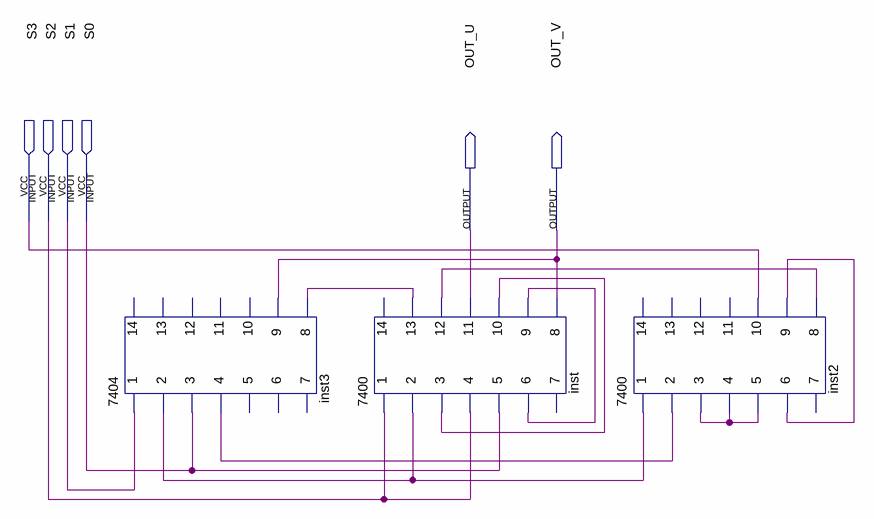
[diagram p0: schematic sheet]
// Quartus schematic BCD_chip_level_reference.bdf as structural Verilog: 3 symbols, 6 pins
module BCD_chip_level_reference (
  input  S3,
  input  S2,
  input  S1,
  input  S0,
  output OUT_U,
  output OUT_V
);

  wire inst2_3, inst2_6, inst2_8, inst3_2, inst3_4, inst3_8, inst_3, inst_6;

  \7404  inst3 (
    .\1 (S1), .\3 (S0), .\9 (OUT_V), .\2 (inst3_2), .\4 (inst3_4), .\8 (inst3_8));  // open: 7, 14, 5, 11, 13, 6, 10, 12
  \7400  inst (
    .\1 (S2), .\2 (inst3_2), .\4 (S2), .\5 (S0), .\9 (inst_6), .\10 (inst_3), .\12 (inst2_8), .\13 (inst3_8),
    .\3 (inst_3), .\6 (inst_6), .\8 (OUT_V), .\11 (OUT_U));  // open: 7, 14
  \7400  inst2 (
    .\1 (inst3_2), .\2 (inst3_4), .\4 (inst2_3), .\5 (inst2_3), .\9 (inst2_6), .\10 (S3), .\3 (inst2_3),
    .\6 (inst2_6), .\8 (inst2_8));  // open: 7, 14, 12, 13, 11
endmodule
